# EAGLE design RelayController_RevB (EAGLE 7.6.0)

## Sheet 1 of 3
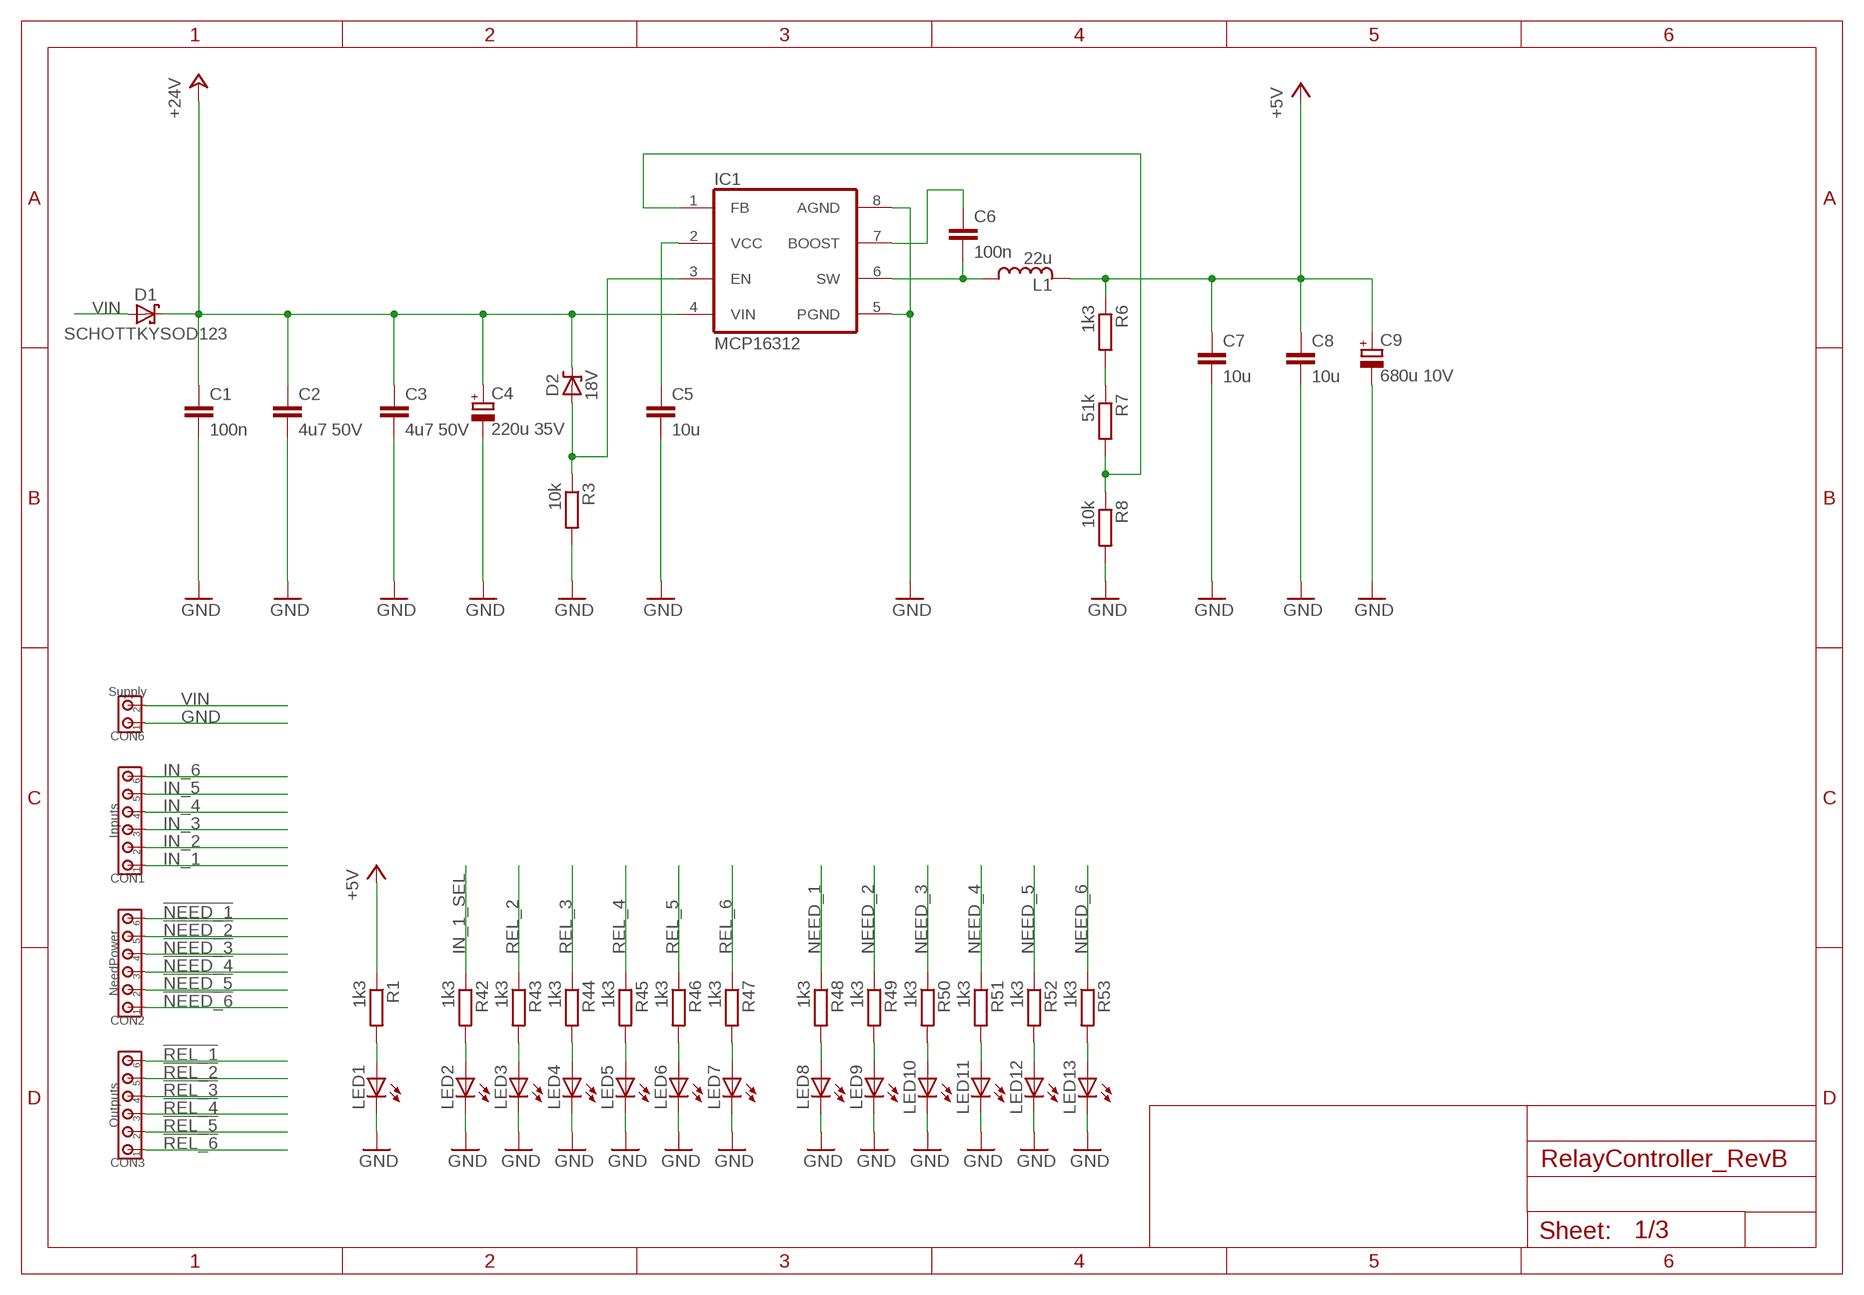
[diagram p0: schematic, sheet 1]

### Parts
C1  100n  CC0805  [C0805]
C2  4u7 50V  CC1206  [C1206]
C3  4u7 50V  CC1206  [C1206]
C4  220u 35V  C_POLARIZED8MM  [8MM]
C5  10u  CC0805  [C0805]
C6  100n  CC0805  [C0805]
C7  10u  CC0805  [C0805]
C8  10u  CC0805  [C0805]
C9  680u 10V  C_POLARIZED8MM  [8MM]
CON1  Inputs  CON_6X3.5MM  [3.5MM_6X]
CON2  NeedPower  CON_6X3.5MM  [3.5MM_6X]
CON3  Outputs  CON_6X3.5MM  [3.5MM_6X]
CON6  Supply  CON_2X3.5MM  [3.5MM_2X]
D1  SCHOTTKYSOD123  [SOD123]
D2  18V  ZENERSOD323  [SOD323]
IC1  MCP16312  MCP16311  [MSOP8]
L1  22u  INDUCTORLPS4018  [LPS4018]
LED1  LED0805_NB  [LED0805_NOBOARDER]
LED2  LED0805_NB  [LED0805_NOBOARDER]
LED3  LED0805_NB  [LED0805_NOBOARDER]
LED4  LED0805_NB  [LED0805_NOBOARDER]
LED5  LED0805_NB  [LED0805_NOBOARDER]
LED6  LED0805_NB  [LED0805_NOBOARDER]
LED7  LED0805_NB  [LED0805_NOBOARDER]
LED8  LED0805_NB  [LED0805_NOBOARDER]
LED9  LED0805_NB  [LED0805_NOBOARDER]
LED10  LED0805_NB  [LED0805_NOBOARDER]
LED11  LED0805_NB  [LED0805_NOBOARDER]
LED12  LED0805_NB  [LED0805_NOBOARDER]
LED13  LED0805_NB  [LED0805_NOBOARDER]
R1  1k3  RESISTORR0805  [R0805]
R3  10k  RESISTORR0805  [R0805]
R6  1k3  RESISTORR0805  [R0805]
R7  51k  RESISTORR0805  [R0805]
R8  10k  RESISTORR0805  [R0805]
R42  1k3  RESISTORR0805  [R0805]
R43  1k3  RESISTORR0805  [R0805]
R44  1k3  RESISTORR0805  [R0805]
R45  1k3  RESISTORR0805  [R0805]
R46  1k3  RESISTORR0805  [R0805]
R47  1k3  RESISTORR0805  [R0805]
R48  1k3  RESISTORR0805  [R0805]
R49  1k3  RESISTORR0805  [R0805]
R50  1k3  RESISTORR0805  [R0805]
R51  1k3  RESISTORR0805  [R0805]
R52  1k3  RESISTORR0805  [R0805]
R53  1k3  RESISTORR0805  [R0805]

### Nets
!NEED_1!: CON2.6 ; also sheet 2
!NEED_2!: CON2.5 ; also sheet 2
!NEED_3!: CON2.4 ; also sheet 2
!NEED_4!: CON2.3 ; also sheet 2
!NEED_5!: CON2.2 ; also sheet 2
!NEED_6!: CON2.1 ; also sheet 2
!REL_1!: CON3.6 ; also sheet 3
!REL_2!: CON3.5 ; also sheet 3
!REL_3!: CON3.4 ; also sheet 3
!REL_4!: CON3.3 ; also sheet 3
!REL_5!: CON3.2 ; also sheet 3
!REL_6!: CON3.1 ; also sheet 3
+5V: C7.1 C8.1 C9.+ L1.2 R1.1 R6.1 ; also sheet 2,3
+24V: C1.1 C2.1 C3.1 C4.+ D1.C D2.C IC1.4(VIN) ; also sheet 2,3
BOOST: C6.1 IC1.7(BOOST)
GND: C1.2 C2.2 C3.2 C4.- C5.2 C7.2 C8.2 C9.- CON6.1 IC1.5(PGND) IC1.8(AGND) LED1.C LED2.C LED3.C LED4.C LED5.C LED6.C LED7.C LED8.C LED9.C LED10.C LED11.C LED12.C LED13.C R3.2 R8.2 ; also sheet 2,3
IN_1: CON1.1 ; also sheet 2
IN_1_SEL: R42.1 ; also sheet 2
IN_2: CON1.2 ; also sheet 2
IN_3: CON1.3 ; also sheet 2
IN_4: CON1.4 ; also sheet 2
IN_5: CON1.5 ; also sheet 2
IN_6: CON1.6 ; also sheet 2
N$1: IC1.1(FB) R7.2 R8.1
N$6: LED1.A R1.2
N$8: D2.A IC1.3(EN) R3.1
N$13: R6.2 R7.1
N$14: C5.1 IC1.2(VCC)
N$17: LED2.A R42.2
N$18: LED3.A R43.2
N$19: LED4.A R44.2
N$20: LED5.A R45.2
N$21: LED6.A R46.2
N$22: LED7.A R47.2
N$23: LED8.A R48.2
N$24: LED9.A R49.2
N$25: LED10.A R50.2
N$26: LED11.A R51.2
N$27: LED12.A R52.2
N$28: LED13.A R53.2
NEED_1: R48.1 ; also sheet 2
NEED_2: R49.1 ; also sheet 2
NEED_3: R50.1 ; also sheet 2
NEED_4: R51.1 ; also sheet 2
NEED_5: R52.1 ; also sheet 2
NEED_6: R53.1 ; also sheet 2
REL_2: R43.1 ; also sheet 2,3
REL_3: R44.1 ; also sheet 2,3
REL_4: R45.1 ; also sheet 2,3
REL_5: R46.1 ; also sheet 2,3
REL_6: R47.1 ; also sheet 2,3
SWITCH: C6.2 IC1.6(SW) L1.1
VIN: CON6.2 D1.A

## Sheet 2 of 3
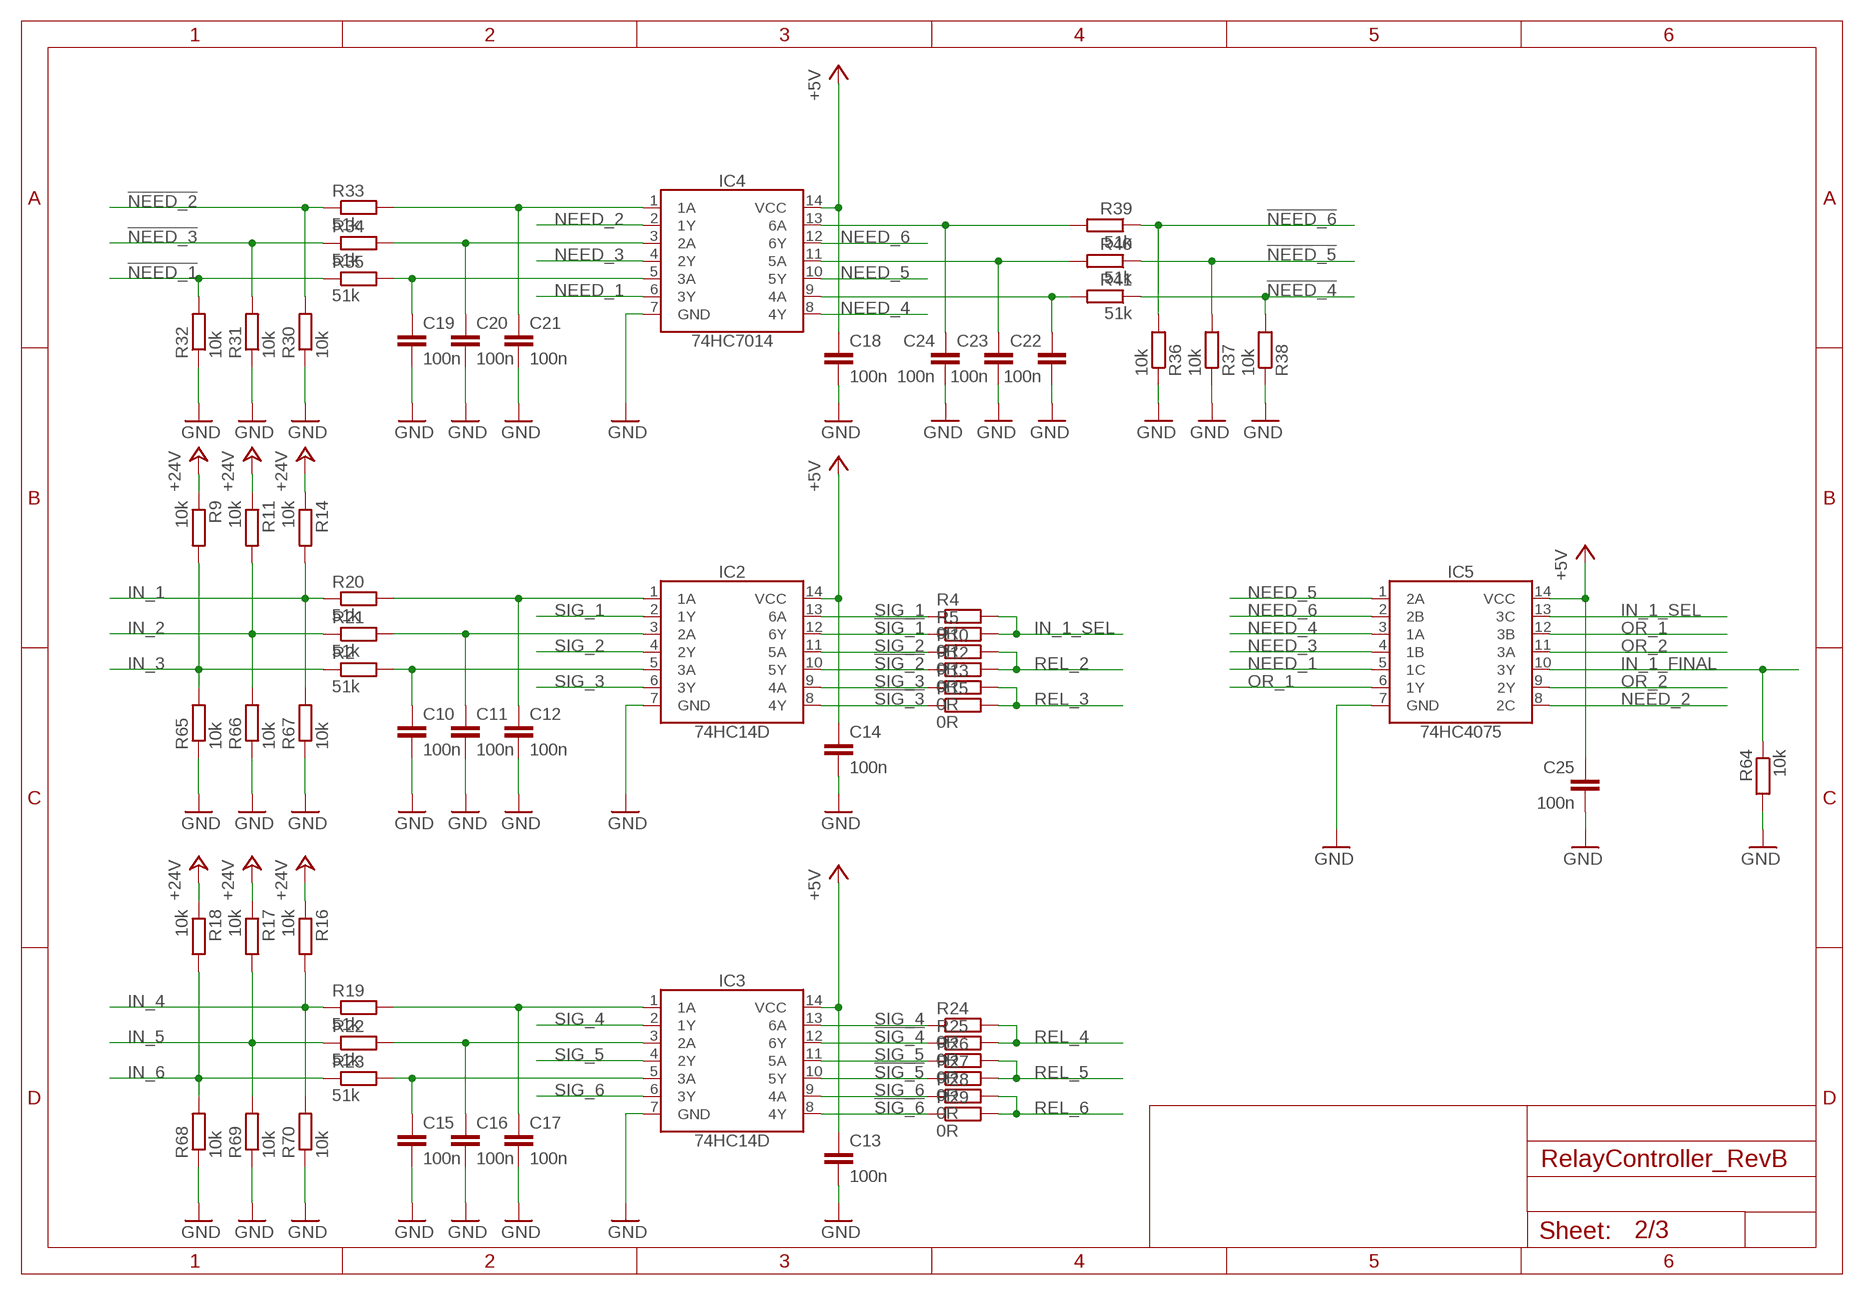
[diagram p1: schematic, sheet 2]

### Parts
C10  100n  CC0805  [C0805]
C11  100n  CC0805  [C0805]
C12  100n  CC0805  [C0805]
C13  100n  CC0805  [C0805]
C14  100n  CC0805  [C0805]
C15  100n  CC0805  [C0805]
C16  100n  CC0805  [C0805]
C17  100n  CC0805  [C0805]
C18  100n  CC0805  [C0805]
C19  100n  CC0805  [C0805]
C20  100n  CC0805  [C0805]
C21  100n  CC0805  [C0805]
C22  100n  CC0805  [C0805]
C23  100n  CC0805  [C0805]
C24  100n  CC0805  [C0805]
C25  100n  CC0805  [C0805]
IC2  74HC14D  [SO14]
IC3  74HC14D  [SO14]
IC4  74HC7014  [SO14]
IC5  74HC4075  [SO14]
R2  51k  RESISTORR0805  [R0805]
R4  0R  RESISTORR0805  [R0805]
R5  0R  RESISTORR0805  [R0805]
R9  10k  RESISTORR0805  [R0805]
R10  0R  RESISTORR0805  [R0805]
R11  10k  RESISTORR0805  [R0805]
R12  0R  RESISTORR0805  [R0805]
R13  0R  RESISTORR0805  [R0805]
R14  10k  RESISTORR0805  [R0805]
R15  0R  RESISTORR0805  [R0805]
R16  10k  RESISTORR0805  [R0805]
R17  10k  RESISTORR0805  [R0805]
R18  10k  RESISTORR0805  [R0805]
R19  51k  RESISTORR0805  [R0805]
R20  51k  RESISTORR0805  [R0805]
R21  51k  RESISTORR0805  [R0805]
R22  51k  RESISTORR0805  [R0805]
R23  51k  RESISTORR0805  [R0805]
R24  0R  RESISTORR0805  [R0805]
R25  0R  RESISTORR0805  [R0805]
R26  0R  RESISTORR0805  [R0805]
R27  0R  RESISTORR0805  [R0805]
R28  0R  RESISTORR0805  [R0805]
R29  0R  RESISTORR0805  [R0805]
R30  10k  RESISTORR0805  [R0805]
R31  10k  RESISTORR0805  [R0805]
R32  10k  RESISTORR0805  [R0805]
R33  51k  RESISTORR0805  [R0805]
R34  51k  RESISTORR0805  [R0805]
R35  51k  RESISTORR0805  [R0805]
R36  10k  RESISTORR0805  [R0805]
R37  10k  RESISTORR0805  [R0805]
R38  10k  RESISTORR0805  [R0805]
R39  51k  RESISTORR0805  [R0805]
R40  51k  RESISTORR0805  [R0805]
R41  51k  RESISTORR0805  [R0805]
R64  10k  RESISTORR0805  [R0805]
R65  10k  RESISTORR0805  [R0805]
R66  10k  RESISTORR0805  [R0805]
R67  10k  RESISTORR0805  [R0805]
R68  10k  RESISTORR0805  [R0805]
R69  10k  RESISTORR0805  [R0805]
R70  10k  RESISTORR0805  [R0805]

### Nets
!NEED_1!: R32.2 R35.1 ; also sheet 1
!NEED_2!: R30.2 R33.1 ; also sheet 1
!NEED_3!: R31.2 R34.1 ; also sheet 1
!NEED_4!: R38.2 R41.1 ; also sheet 1
!NEED_5!: R37.2 R40.1 ; also sheet 1
!NEED_6!: R36.2 R39.1 ; also sheet 1
!SIG_1!: IC2.12(6Y) R5.1
!SIG_2!: IC2.10(5Y) R12.1
!SIG_3!: IC2.8(4Y) R15.1
!SIG_4!: IC3.12(6Y) R25.1
!SIG_5!: IC3.10(5Y) R27.1
!SIG_6!: IC3.8(4Y) R29.1
+5V: C13.1 C14.1 C18.1 C25.1 IC2.14(VCC) IC3.14(VCC) IC4.14(VCC) IC5.14(VCC) ; also sheet 1,3
+24V: R9.1 R11.1 R14.1 R16.1 R17.1 R18.1 ; also sheet 1,3
FOO: C10.1 IC2.5(3A) R2.2
FOO1: C15.1 IC3.5(3A) R23.2
GND: C10.2 C11.2 C12.2 C13.2 C14.2 C15.2 C16.2 C17.2 C18.2 C19.2 C20.2 C21.2 C22.2 C23.2 C24.2 C25.2 IC2.7(GND) IC3.7(GND) IC4.7(GND) IC5.7(GND) R30.1 R31.1 R32.1 R36.1 R37.1 R38.1 R64.2 R65.1 R66.1 R67.1 R68.1 R69.1 R70.1 ; also sheet 1,3
IN_1: R14.2 R20.1 R67.2 ; also sheet 1
IN_1_FINAL: IC5.10(3Y) R64.1 ; also sheet 3
IN_1_SEL: IC5.13(3C) R4.2 R5.2 ; also sheet 1
IN_2: R11.2 R21.1 R66.2 ; also sheet 1
IN_3: R2.1 R9.2 R65.2 ; also sheet 1
IN_4: R16.2 R19.1 R70.2 ; also sheet 1
IN_5: R17.2 R22.1 R69.2 ; also sheet 1
IN_6: R18.2 R23.1 R68.2 ; also sheet 1
N$2: C17.1 IC3.1(1A) R19.2
N$4: C16.1 IC3.3(2A) R22.2
N$5: C21.1 IC4.1(1A) R33.2
N$11: C20.1 IC4.3(2A) R34.2
N$12: C24.1 IC4.13(6A) R39.2
N$15: C23.1 IC4.11(5A) R40.2
N$16: C22.1 IC4.9(4A) R41.2
N$40: C12.1 IC2.1(1A) R20.2
N$41: C11.1 IC2.3(2A) R21.2
N$111: C19.1 IC4.5(3A) R35.2
NEED_1: IC4.6(3Y) IC5.5(1C) ; also sheet 1
NEED_2: IC4.2(1Y) IC5.8(2C) ; also sheet 1
NEED_3: IC4.4(2Y) IC5.4(1B) ; also sheet 1
NEED_4: IC4.8(4Y) IC5.3(1A) ; also sheet 1
NEED_5: IC4.10(5Y) IC5.1(2A) ; also sheet 1
NEED_6: IC4.12(6Y) IC5.2(2B) ; also sheet 1
OR_1: IC5.6(1Y) IC5.12(3B)
OR_2: IC5.9(2Y) IC5.11(3A)
REL_2: R10.2 R12.2 ; also sheet 1,3
REL_3: R13.2 R15.2 ; also sheet 1,3
REL_4: R24.2 R25.2 ; also sheet 1,3
REL_5: R26.2 R27.2 ; also sheet 1,3
REL_6: R28.2 R29.2 ; also sheet 1,3
SIG_1: IC2.2(1Y) IC2.13(6A) R4.1
SIG_2: IC2.4(2Y) IC2.11(5A) R10.1
SIG_3: IC2.6(3Y) IC2.9(4A) R13.1
SIG_4: IC3.2(1Y) IC3.13(6A) R24.1
SIG_5: IC3.4(2Y) IC3.11(5A) R26.1
SIG_6: IC3.6(3Y) IC3.9(4A) R28.1

## Sheet 3 of 3
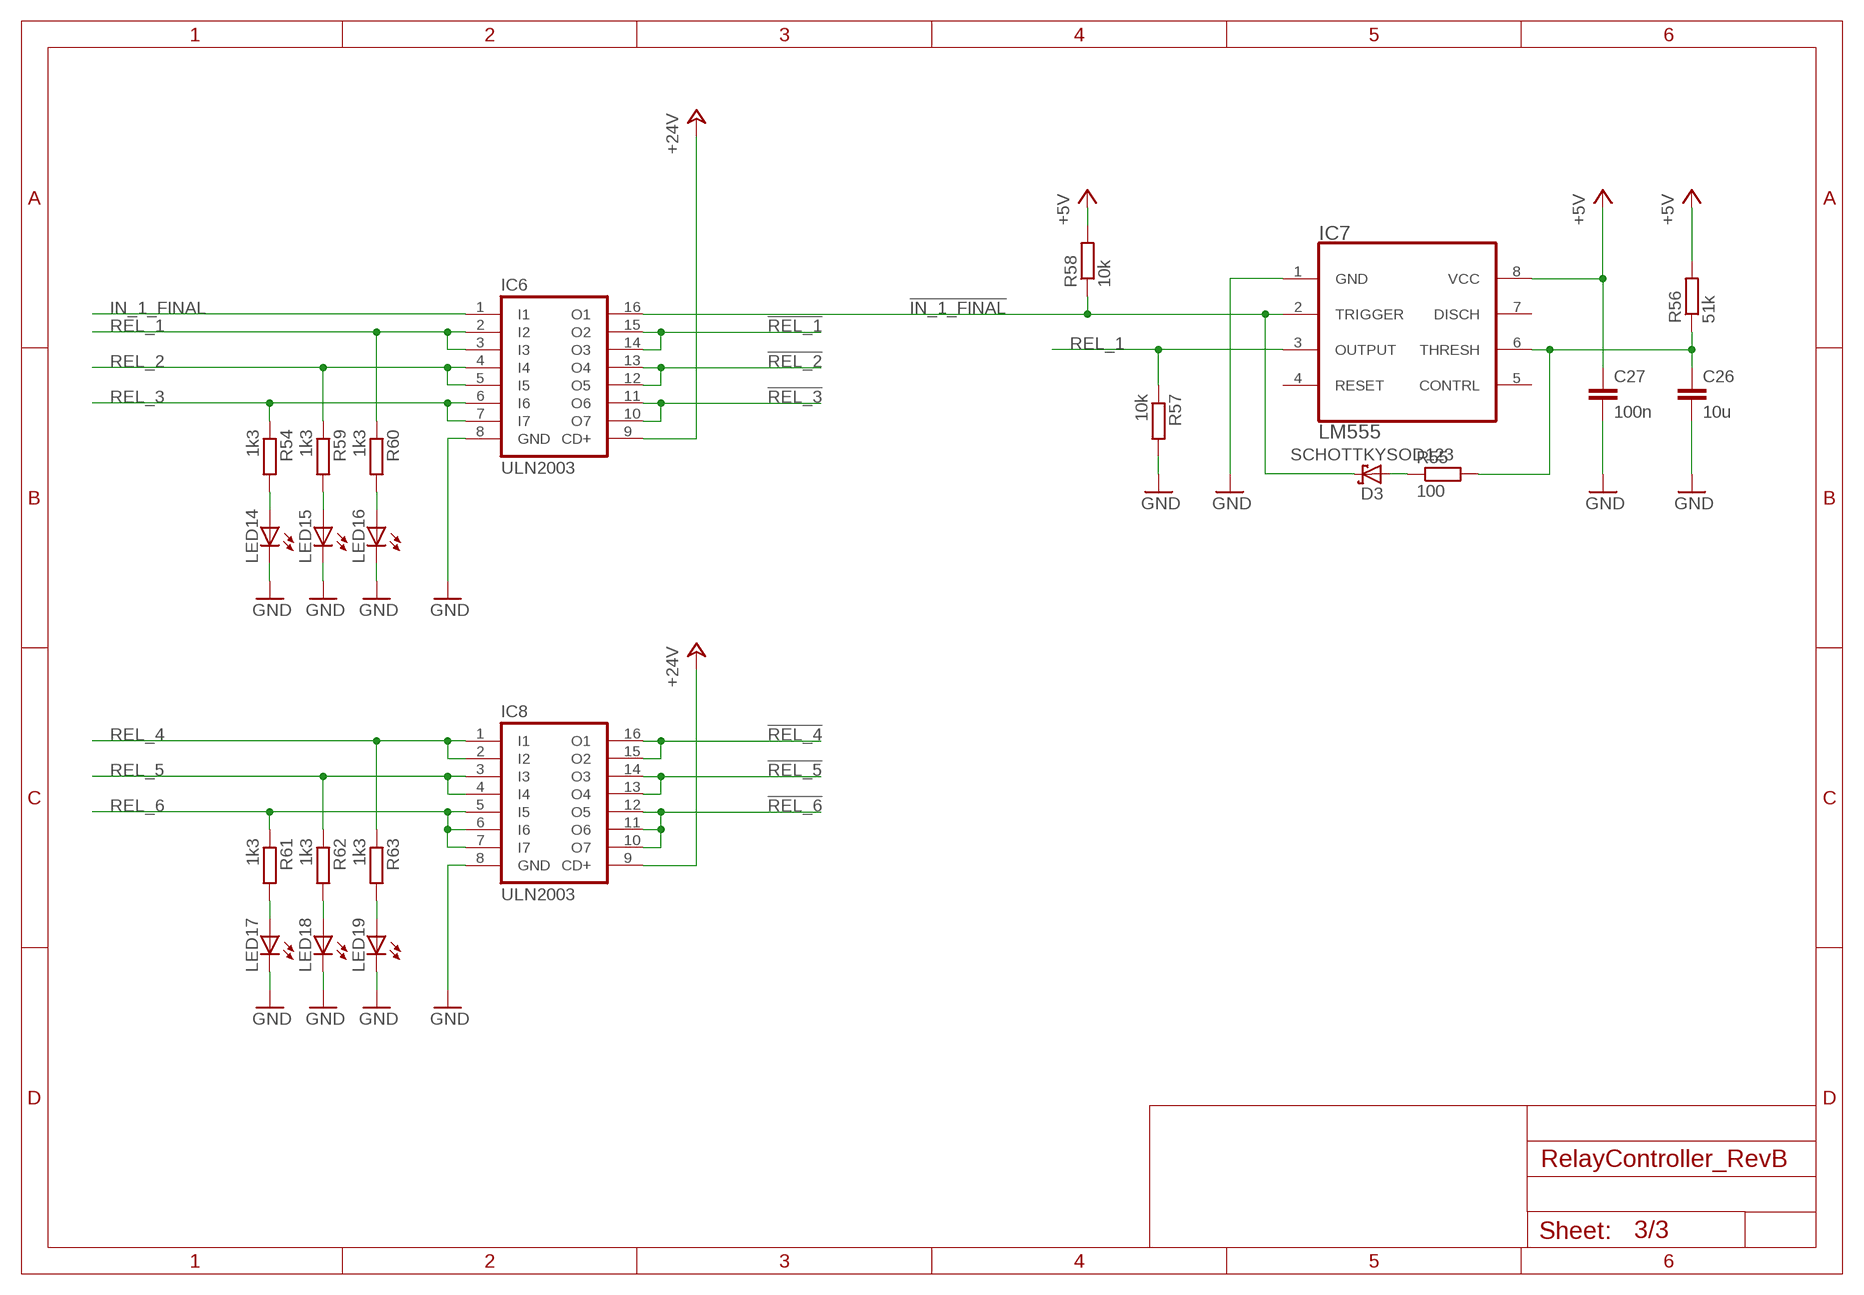
[diagram p2: schematic, sheet 3]

### Parts
C26  10u  CC0805  [C0805]
C27  100n  CC0805  [C0805]
D3  SCHOTTKYSOD123  [SOD123]
IC6  ULN2003  [SO16]
IC7  LM555  [SOIC8]
IC8  ULN2003  [SO16]
LED14  LED0805_NB  [LED0805_NOBOARDER]
LED15  LED0805_NB  [LED0805_NOBOARDER]
LED16  LED0805_NB  [LED0805_NOBOARDER]
LED17  LED0805_NB  [LED0805_NOBOARDER]
LED18  LED0805_NB  [LED0805_NOBOARDER]
LED19  LED0805_NB  [LED0805_NOBOARDER]
R54  1k3  RESISTORR0805  [R0805]
R55  100  RESISTORR0805  [R0805]
R56  51k  RESISTORR0805  [R0805]
R57  10k  RESISTORR0805  [R0805]
R58  10k  RESISTORR0805  [R0805]
R59  1k3  RESISTORR0805  [R0805]
R60  1k3  RESISTORR0805  [R0805]
R61  1k3  RESISTORR0805  [R0805]
R62  1k3  RESISTORR0805  [R0805]
R63  1k3  RESISTORR0805  [R0805]

### Nets
!IN_1_FINAL!: D3.C IC6.16(O1) IC7.2(TRIGGER) R58.1
!REL_1!: IC6.14(O3) IC6.15(O2) ; also sheet 1
!REL_2!: IC6.12(O5) IC6.13(O4) ; also sheet 1
!REL_3!: IC6.10(O7) IC6.11(O6) ; also sheet 1
!REL_4!: IC8.15(O2) IC8.16(O1) ; also sheet 1
!REL_5!: IC8.13(O4) IC8.14(O3) ; also sheet 1
!REL_6!: IC8.10(O7) IC8.11(O6) IC8.12(O5) ; also sheet 1
+5V: C27.1 IC7.8(VCC) R56.2 R58.2 ; also sheet 1,2
+24V: IC6.9(CD+) IC8.9(CD+) ; also sheet 1,2
GND: C26.2 C27.2 IC6.8(GND) IC7.1(GND) IC8.8(GND) LED14.C LED15.C LED16.C LED17.C LED18.C LED19.C R57.2 ; also sheet 1,2
IN_1_FINAL: IC6.1(I1) ; also sheet 2
N$29: C26.1 IC7.6(THRESH) R55.2 R56.1
N$30: D3.A R55.1
N$31: LED14.A R54.2
N$32: LED15.A R59.2
N$33: LED16.A R60.2
N$34: LED17.A R61.2
N$35: LED18.A R62.2
N$36: LED19.A R63.2
REL_1: IC6.2(I2) IC6.3(I3) IC7.3(OUTPUT) R57.1 R60.1
REL_2: IC6.4(I4) IC6.5(I5) R59.1 ; also sheet 1,2
REL_3: IC6.6(I6) IC6.7(I7) R54.1 ; also sheet 1,2
REL_4: IC8.1(I1) IC8.2(I2) R63.1 ; also sheet 1,2
REL_5: IC8.3(I3) IC8.4(I4) R62.1 ; also sheet 1,2
REL_6: IC8.5(I5) IC8.6(I6) IC8.7(I7) R61.1 ; also sheet 1,2
Unconnected: IC7.4(RESET) IC7.5(CONTRL) IC7.7(DISCH)

## Library data of the parts
C1-C3 C5-C8 C10-C27 = 00Capacitor:C: Capacitor
C4 C9 = 00Capacitor:C_POLARIZED
CON1-CON3 = 00Connector:CON_6X: 6-pin header
CON6 = 00Connector:CON_2X: 2-pin header
D1 D3 = 00Diode:SCHOTTKY
D2 = 00Diode:ZENER
IC1 = 00VoltageRegulator:MCP16311
IC2 IC3 = 00Logic:74HC14: Hex Inverter Schmitt Trigger
IC4 = 00Logic:74HC7014: Hex non-inverting precision Schmitt-trigger
IC5 = 00Logic:74HC4075: Triple 3-input OR gate
IC6 IC8 = 00Transistor:ULN2003: Seven Darlington array
IC7 = 00Logic:LM555
L1 = 00Inductor:INDUCTOR
LED1-LED19 = 00Display:LED: LED
R1-R70 = 00Resistor:RESISTOR: RESISTOR, European symbol

## Net classes
1 24V: clearance 0.305 mm
5 +5v: width 0.61 mm, drill 0.6 mm, clearance 0.254 mm to class 0, clearance 0.254 mm to class 1, clearance 0.254 mm to class 2, clearance 0.254 mm to class 3, clearance 0.254 mm to class 4, clearance 0.254 mm

## Board
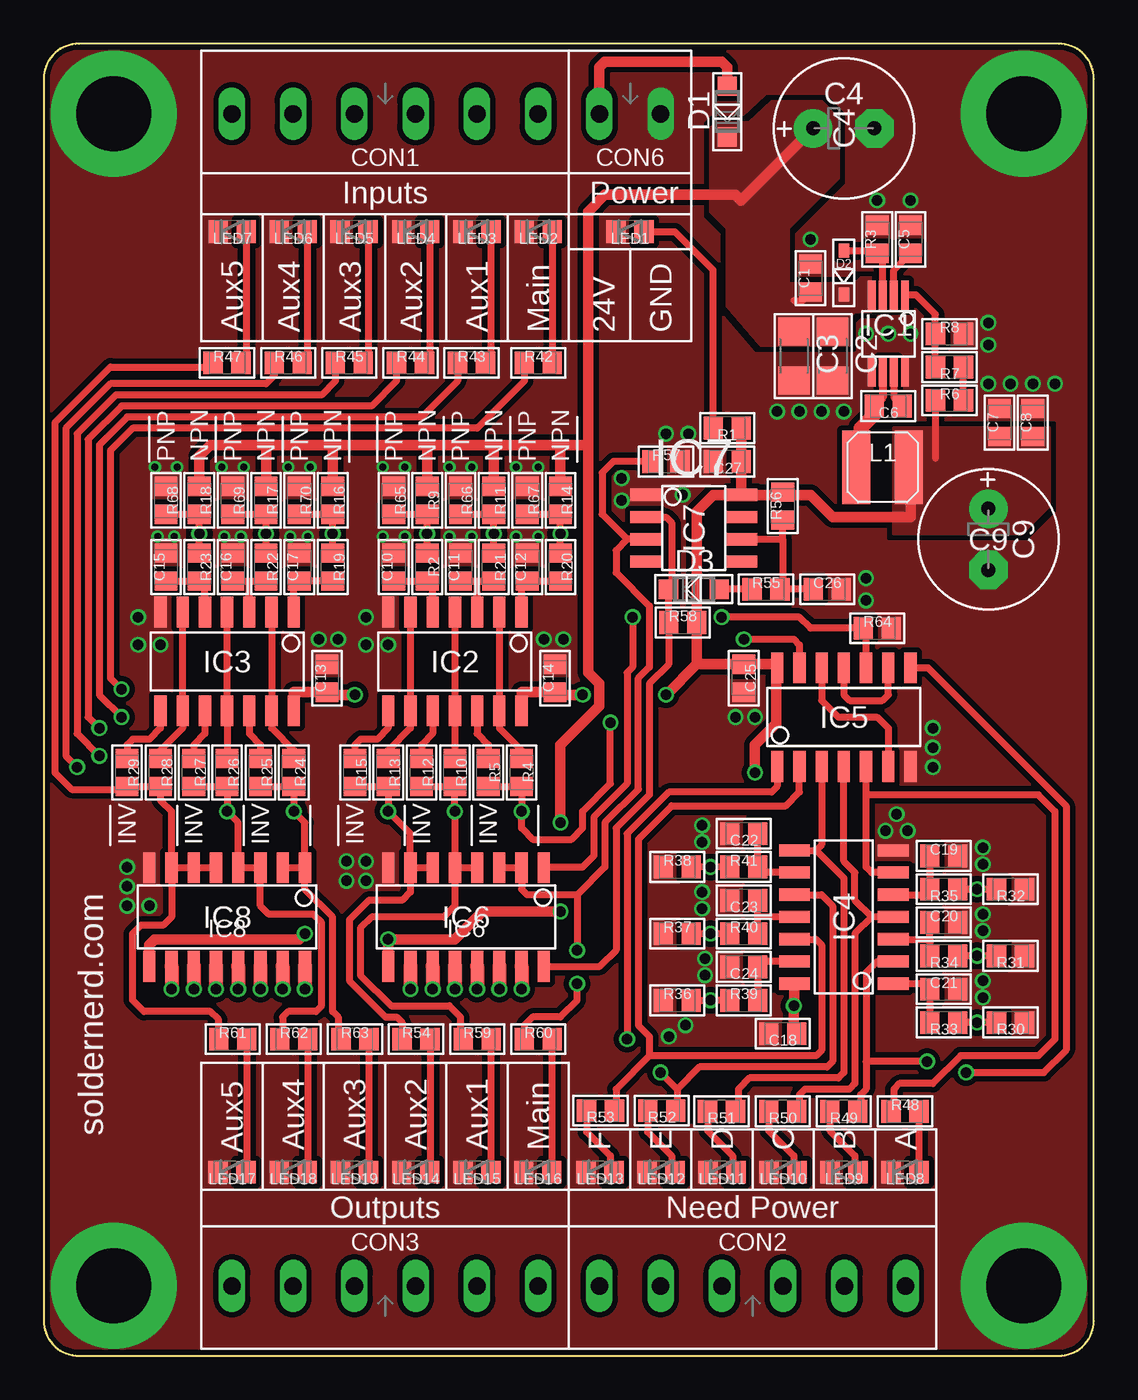
[diagram p3: board, top side]
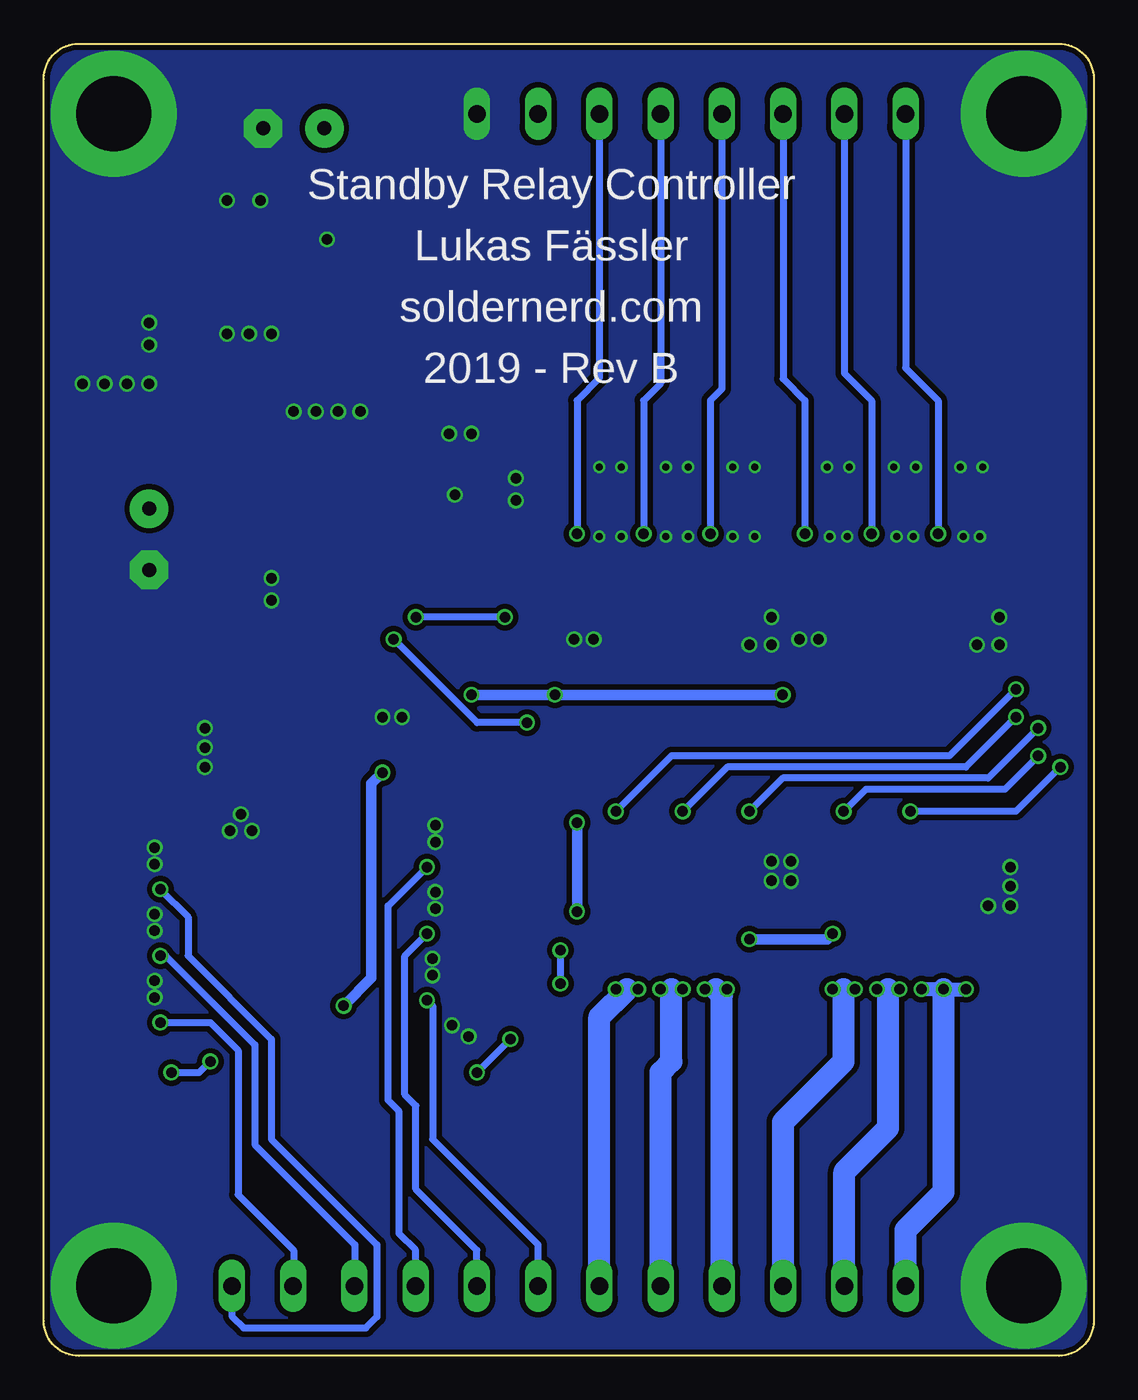
[diagram p4: board, bottom side, seen from below]

Size 60 x 75 mm. Coordinates in mm from the lower left corner, seen from the top.
Outline: 58,0 arc90 60,2 60,73 arc90 58,75 2,75 arc90 0,73 0,2 arc90 2,0 58,0
Copper layers (1*16): Top 0.035mm / dielectric 1.5mm / Bottom 0.035mm
Design rules "dirt_cheap_dirty_boards.7mil": minimum track width 5mil, minimum drill 12mil, track to track 7mil, track to pad 7mil, pad to pad 7mil, via to via 7mil, smd to smd 0mil, copper to edge 10mil, drill to drill 10mil, minimum pad ring 10mil, minimum via ring 6mil, stop-mask expansion 2mil, vias tented up to drill 25mil, thermal gap 10mil

### Footprints (pad centres in the part's own frame; a part is rotated, then mirrored left to right if it is on the bottom)
C0805 = smd 1.1 x 1.3: 1 -0.8,0; 2 0.8,0
C1206 = smd 1.6 x 1.8: 1 -1.4,0; 2 1.4,0
8MM = drill 0.8 pad 2.2: + -1.75,0 | drill 0.8 pad 2.2 octagon: - 1.75,0
3.5MM_6X = drill 1 long: 1 -8.75,0; 2 -5.25,0; 3 -1.75,0; 4 1.75,0; 5 5.25,0; 6 8.75,0
3.5MM_2X = drill 1 long: 1 -1.75,0; 2 1.75,0
SOD123 = smd 1.1 x 1.1: A 1.45,0; C -1.45,0
SOD323 = smd 0.8 x 0.6: A 1.25,0; C -1.25,0
MSOP8 = smd 1.65 x 0.45: 1 -2.2,0.953; 2 -2.2,0.318; 3 -2.2,-0.318; 4 -2.2,-0.953; 5 2.2,-0.953; 6 2.2,-0.318; 7 2.2,0.318; 8 2.2,0.953
SO14 = smd 0.7 x 1.75: 1 -3.81,-2.825; 2 -2.54,-2.825; 3 -1.27,-2.825; 4 0,-2.825; 5 1.27,-2.825; 6 2.54,-2.825; 7 3.81,-2.825; 8 3.81,2.825; 9 2.54,2.825; 10 1.27,2.825; 11 0,2.825; 12 -1.27,2.825; 13 -2.54,2.825; 14 -3.81,2.825
SO16 = smd 0.7 x 1.75: 1 -4.445,-2.825; 2 -3.175,-2.825; 3 -1.905,-2.825; 4 -0.635,-2.825; 5 0.635,-2.825; 6 1.905,-2.825; 7 3.175,-2.825; 8 4.445,-2.825; 9 4.445,2.825; 10 3.175,2.825; 11 1.905,2.825; 12 0.635,2.825; 13 -0.635,2.825; 14 -1.905,2.825; 15 -3.175,2.825; 16 -4.445,2.825
SOIC8 = smd 1.75 x 0.7: 1 -2.75,1.905; 2 -2.75,0.635; 3 -2.75,-0.635; 4 -2.75,-1.905; 5 2.75,-1.905; 6 2.75,-0.635; 7 2.75,0.635; 8 2.75,1.905
LPS4018 = smd 1.6 x 4.2: 1 -1.5,0; 2 1.5,0
LED0805_NOBOARDER = smd 1.1 x 1.3: A -0.8,0; C 0.8,0
R0805 = smd 1.1 x 1.3: 1 -0.8,0; 2 0.8,0

### Placement (x,y rotation side)
C1  43.81,61.59 90 top
C2  45.09,57.15 270 top
C3  42.86,57.15 270 top
C4  45.72,70.17 0 top
C5  49.53,63.82 90 top
C6  48.26,54.29 180 top
C7  54.61,53.34 90 top
C8  56.52,53.34 90 top
C9  53.98,46.67 270 top
C10  20,45.09 90 top
C11  23.81,45.09 90 top
C12  27.62,45.09 90 top
C13  16.19,38.73 90 top
C14  29.21,38.73 90 top
C15  6.99,45.09 90 top
C16  10.79,45.09 90 top
C17  14.61,45.09 90 top
C18  42.23,18.41 180 top
C19  51.44,28.57 0 top
C20  51.44,24.77 0 top
C21  51.44,20.95 0 top
C22  40.01,29.84 180 top
C23  40.01,26.04 180 top
C24  40.01,22.23 180 top
C25  40.01,38.73 270 top
C26  44.77,43.81 0 top
C27  39.05,51.12 180 top
CON1  19.5,71 180 top
CON2  40.5,4 0 top
CON3  19.5,4 0 top
CON6  33.5,71 180 top
D1  39.05,71.12 90 top
D2  45.72,61.91 90 top
D3  37.15,43.81 0 top
IC1  48.26,58.42 270 top
IC2  23.5,39.69 180 top
IC3  10.48,39.69 180 top
IC4  45.72,25.08 90 top
IC5  45.72,36.51 0 top
IC6  24.13,25.08 180 top
IC7  37.15,47.31 0 top
IC8  10.48,25.08 180 top
L1  47.94,50.8 0 top
LED1  33.5,64.25 180 top
LED2  28.25,64.25 180 top
LED3  24.75,64.25 180 top
LED4  21.25,64.25 180 top
LED5  17.73,64.25 180 top
LED6  14.25,64.25 180 top
LED7  10.77,64.25 180 top
LED8  49.21,10.5 180 top
LED9  45.73,10.5 180 top
LED10  42.24,10.5 180 top
LED11  38.76,10.5 180 top
LED12  35.27,10.5 180 top
LED13  31.79,10.5 180 top
LED14  21.25,10.5 180 top
LED15  24.75,10.5 180 top
LED16  28.23,10.5 180 top
LED17  10.75,10.5 180 top
LED18  14.25,10.5 180 top
LED19  17.75,10.5 180 top
R1  39.05,53.02 180 top
R2  21.91,45.09 270 top
R3  47.62,63.82 90 top
R4  27.3,33.34 270 top
R5  25.4,33.34 270 top
R6  51.75,54.61 0 top
R7  51.75,56.52 180 top
R8  51.75,58.42 0 top
R9  21.91,48.9 270 top
R10  23.5,33.34 270 top
R11  25.72,48.9 270 top
R12  21.59,33.34 270 top
R13  19.68,33.34 270 top
R14  29.53,48.9 270 top
R15  17.78,33.34 270 top
R16  16.51,48.9 270 top
R17  12.7,48.9 270 top
R18  8.89,48.9 270 top
R19  16.51,45.09 270 top
R20  29.53,45.09 270 top
R21  25.72,45.09 270 top
R22  12.7,45.09 270 top
R23  8.89,45.09 270 top
R24  14.29,33.34 270 top
R25  12.38,33.34 270 top
R26  10.48,33.34 270 top
R27  8.57,33.34 270 top
R28  6.67,33.34 270 top
R29  4.76,33.34 270 top
R30  55.24,19.05 180 top
R31  55.24,22.86 180 top
R32  55.24,26.67 180 top
R33  51.44,19.05 180 top
R34  51.44,22.86 180 top
R35  51.44,26.67 180 top
R36  36.2,20.32 0 top
R37  36.2,24.13 0 top
R38  36.2,27.94 0 top
R39  40.01,20.32 0 top
R40  40.01,24.13 0 top
R41  40.01,27.94 0 top
R42  28.26,56.75 0 top
R43  24.45,56.75 0 top
R44  20.95,56.75 0 top
R45  17.46,56.75 0 top
R46  13.97,56.75 0 top
R47  10.48,56.75 0 top
R48  49.21,13.97 0 top
R49  45.72,13.97 180 top
R50  42.23,13.97 180 top
R51  38.73,13.97 180 top
R52  35.31,14.02 180 top
R53  31.82,14.02 180 top
R54  21.27,18.1 0 top
R55  41.27,43.81 0 top
R56  42.23,48.58 90 top
R57  35.56,51.12 0 top
R58  36.51,41.91 0 top
R59  24.77,18.1 0 top
R60  28.26,18.1 0 top
R61  10.79,18.1 0 top
R62  14.29,18.1 0 top
R63  17.78,18.1 0 top
R64  47.62,41.59 0 top
R65  20,48.9 270 top
R66  23.81,48.9 270 top
R67  27.62,48.9 270 top
R68  6.99,48.9 270 top
R69  10.79,48.9 270 top
R70  14.61,48.9 270 top

### Tracks (layer width: path | path; a pad name or v marks a point on that pad's centre or on a via)
!IN_1_FINAL!
  Top 0.406: IC6.16 31.78,22.26 32.7,23.18 32.7,30.16 34.61,32.07 34.61,38.42 35.71,39.52 R58.1 35.71,43.8 D3.C 35.88,43.99 35.88,47.62 35.56,47.94 IC7.2
!NEED_1!  (via drill 0.6)
  Top 0.406: R32.2 v53.34,26.67 R35.1
  Bottom 0.406: CON2.6 49.25,2.26 48.58,1.59 41.59,1.59 40.96,2.22 40.96,6.35 46.99,12.38 46.99,18.1 51.75,22.86 51.75,25.08 v53.34,26.67
!NEED_2!  (via drill 0.6)
  Top 0.406: R30.2 v53.34,19.05 R33.1
  Bottom 0.406: 45.72,3.97 45.72,6.03 48.9,9.21 48.9,17.46 50.48,19.05 v53.34,19.05 | 45.72,3.97 45.72,3.78 | CON2.5 45.72,3.97
!NEED_3!  (via drill 0.6)
  Top 0.406: R31.2 v53.34,22.86 R34.1
  Bottom 0.406: v53.34,22.86 53.02,22.86 47.94,17.78 47.94,12.06 42.23,6.35 42.23,4.02 CON2.4
!NEED_4!  (via drill 0.6)
  Top 0.406: R41.1 v38.1,27.94 R38.2
  Bottom 0.406: CON2.3 38.75,6.05 39.69,6.99 39.69,13.97 40.32,14.61 40.32,25.72 v38.1,27.94
!NEED_5!  (via drill 0.6)
  Top 0.406: R37.2 v38.1,24.13 R40.1
  Bottom 0.406: CON2.2 35.25,6.04 38.73,9.53 38.73,14.29 39.37,14.92 39.37,22.86 v38.1,24.13
!NEED_6!  (via drill 0.6)
  Top 0.406: R39.1 v38.1,20.32 R36.2
  Bottom 0.406: CON2.1 31.75,6.35 37.78,12.38 37.78,20 v38.1,20.32
!REL_1!  (via drill 0.6)
  Top 0.813: IC6.15 v27.3,20.95 | IC6.14 v26.04,20.95
  Bottom 0.813: v26.04,20.95 26.67,20.95 v27.3,20.95
  Bottom 1.27: CON3.6 28.25,19.38 26.67,20.95
!REL_2!  (via drill 0.6)
  Top 0.813: IC6.13 v24.77,20.95 | IC6.12 v23.5,20.95
  Bottom 0.813: v23.5,20.95 24.13,20.95 v24.77,20.95
  Bottom 1.27: CON3.5 24.75,16.21 24.13,16.83 24.13,20.95
!REL_3!  (via drill 0.6)
  Top 0.813: IC6.11 v22.23,20.95 | IC6.10 v20.95,20.95
  Bottom 0.813: v22.23,20.95 21.59,20.95 v20.95,20.95
  Bottom 1.27: CON3.4 21.25,20.61 21.59,20.95
!REL_4!  (via drill 0.6)
  Top 0.813: IC8.16 v14.92,20.95 | IC8.15 v13.65,20.95
  Bottom 0.813: v13.65,20.95 14.29,20.95 v14.92,20.95
  Bottom 1.27: CON3.3 17.75,13.37 14.29,16.83 14.29,20.95
!REL_5!  (via drill 0.6)
  Top 0.813: IC8.14 v12.38,20.95 | IC8.13 v11.11,20.95
  Bottom 0.813: v12.38,20.95 11.75,20.95 v11.11,20.95
  Bottom 1.27: CON3.2 14.25,10.52 11.75,13.02 11.75,20.95
!REL_6!  (via drill 0.6)
  Top 0.813: IC8.10 v7.3,20.95 | IC8.12 v9.84,20.95 | IC8.11 v8.57,20.95
  Bottom 0.813: v7.3,20.95 v8.57,20.95 v9.84,20.95
  Bottom 1.27: CON3.1 10.75,7.19 8.57,9.37 v8.57,20.95
!SIG_1!
  Top 0.406: IC2.12 24.77,35.56 25.4,34.92 R5.1
!SIG_2!
  Top 0.406: IC2.10 22.23,35.56 21.59,34.92 R12.1
!SIG_3!
  Top 0.406: IC2.8 19.68,35.88 19.05,35.24 18.1,35.24 17.78,34.92 R15.1
!SIG_4!
  Top 0.406: IC3.12 11.75,35.56 12.38,34.92 R25.1
!SIG_5!
  Top 0.406: IC3.10 9.21,35.56 8.57,34.92 R27.1
!SIG_6!
  Top 0.406: IC3.8 6.67,35.88 6.03,35.24 5.08,35.24 4.76,34.92 R29.1
+5V  (via drill 0.6)
  Top 0.406: R6.1 50.95,51.29
  Top 0.61: R1.1 C27.1 39.85,49.26 IC7.8 | v17.78,37.78 16.34,37.78 C13.1 14.29,37.94 IC3.14 | v30.8,37.78 29.36,37.78 C14.1 27.3,37.94 IC2.14 | IC4.14 42.9,20.04 v42.86,20 42.86,18.58 C18.1 | IC7.8 38.26,49.21 37.31,48.27 R58.2 37.31,39.69 37.47,39.53 | IC7.8 42.06,49.21 R56.2 42.39,49.21 43.81,49.21 45.09,47.94 49.53,47.94 49.53,50.71 L1.2 | v40.64,33.34 40.64,34.92 41.85,36.14 41.85,39.28 IC5.14 41.71,39.53 C25.1 37.47,39.53 | 37.47,39.53 37.31,39.53 v35.56,37.78
  Bottom 0.61: v17.78,37.78 v30.8,37.78 v35.56,37.78 | v42.86,20 41.27,21.59 41.27,32.7 v40.64,33.34
  pour Top (isolate 0.406, no thermals): 48.58,53.02 57.47,53.02 57.47,48.58 55.88,46.99 48.58,46.99
+24V  (via drill 0.6)
  Top 0.406: 42.86,60.33 43.34,60.33
  Top 0.61: IC6.9 v19.68,23.81 23.5,23.81 25.08,25.4 v29.53,25.4 | R18.1 8.89,51.44 9.53,52.07 12.7,52.07 | 12.7,52.07 16.51,52.07 | 16.51,52.07 21.91,52.07 | 21.91,52.07 25.72,52.07 | 25.72,52.07 29.53,52.07 | R14.1 29.53,52.07 | R11.1 25.72,52.07 | R9.1 21.91,52.07 | R16.1 16.51,52.07 | R17.1 12.7,52.07 | IC8.9 6.03,23.5 6.35,23.81 14.61,23.81 v14.92,24.13 | C4.+ 39.84,66.04 39.52,66.36 32.07,66.36 31.11,65.41 31.11,52.07 | 29.53,52.07 31.11,52.07 | 31.11,52.07 31.11,39.05 31.75,38.42 31.75,37.15 29.53,34.92 v29.53,30.48
  Bottom 0.61: v29.53,30.48 v29.53,25.4 | v14.92,24.13 15.24,23.81 v19.68,23.81
  pour Top (isolate 0.406, no thermals): 47.31,61.59 47.31,59.69 46.35,59.69 46.04,59.37 46.04,57.78 40.96,57.78 39.05,60.01 39.05,64.45 38.1,65.41 38.1,70.17 38.42,70.48 40.32,70.48 41.59,71.67 44.45,71.67 45.4,70.72 45.4,67.31 42.55,64.45 42.55,61.28 46.35,61.28 46.67,61.59
BOOST
  Top 0.406: IC1.7 48.58,54.77 C6.1
FOO
  Top 0.406: C10.1 R2.2 22.23,43.97 IC2.5
FOO1
  Top 0.406: C15.1 R23.2 9.21,44.28 IC3.5
GND  (via drill 0.4, 0.6, 4.3 pad 7.2)
  other vias: 4,71 56,71 56,4 4,4 41.91,53.98 45.72,53.98 43.81,63.82 6.67,40.64 53.66,21.43 53.66,25.24 14.08,46.83 20.64,46.83 37.62,29.37 53.66,28.1 10.32,46.83 5.4,42.23 37.62,25.56 16.83,40.96 37.78,22.7 50.8,33.66 49.37,30 35.56,52.7 39.53,36.51 29.69,40.96 53.98,55.56 56.52,55.56 50.8,34.77 19.37,46.83 23.18,46.83 24.45,46.83 26.99,46.83 28.26,46.83 6.35,50.8 7.62,50.8 10.16,50.8 11.43,50.8 13.97,50.8 15.24,50.8 20.64,50.8 19.37,50.8 28.26,50.8 26.99,50.8 24.45,50.8 23.18,50.8 36.67,18.89 35.72,18.26 46.99,58.42 48.26,58.42 49.53,58.42 57.78,55.56 55.24,55.56 44.45,53.98 43.18,53.98 47.62,66.04 49.53,66.04 53.98,59.05 53.98,57.78 33.02,50.16 33.02,48.9 36.51,49.21 36.83,52.7 46.99,44.45 46.99,43.18 40.64,36.51 50.8,35.88 48.1,30 48.74,30.96 53.66,29.05 53.66,24.29 37.62,30.32 37.62,26.51 37.78,21.75 53.66,20.48 4.76,27.94 4.76,26.83 4.76,25.72 6.03,25.72 17.3,28.26 18.41,28.26 18.41,27.15 17.3,27.15 5.4,40.64 15.72,40.96 18.41,42.23 19.68,40.64 18.41,40.64 28.57,40.96 15.08,46.83 11.27,46.83 7.46,46.83 6.51,46.83
  pour Bottom (isolate 0.305, rank 3, no thermals): 58,0 2,0 arc-90 0,2 0,73 arc-90 2,75 58,75 arc-90 60,73 60,2 arc-90
  pour Top (isolate 0.305, rank 3, no thermals): 0,2 0,73 arc-90 2,75 58,75 arc-90 60,73 60,2 arc-90 58,0 2,0 arc-90
IN_1  (via drill 0.6)
  Top 0.406: R20.1 v29.53,46.99 R14.2 R67.2
  Bottom 0.406: CON1.1 28.25,55.89 29.53,54.61 v29.53,46.99
IN_1_FINAL  (via drill 0.6)
  Top 0.406: IC6.1 28.57,27.94 30.8,27.94 31.43,28.57 31.43,30.8 33.34,32.7 33.34,39.05 33.66,39.37 v33.66,42.23 | IC5.10 46.99,41.43 R64.1 43.81,41.59 43.18,42.23 v38.73,42.23
  Bottom 0.406: v33.66,42.23 v38.73,42.23
IN_1_SEL  (via drill 0.6)
  Top 0.406: R42.1 27.46,55.72 24.77,53.02 5.08,53.02 3.81,51.75 3.81,38.73 v4.45,38.1 | R5.2 R4.2 v27.3,31.11 27.3,30.16 27.94,29.53 30.16,29.53 30.8,30.16 30.8,31.11 32.38,32.7 v32.38,36.2 | v40.01,40.96 42.86,40.96 43.18,40.64 IC5.13
  Bottom 0.406: v4.45,38.1 8.26,34.29 24.13,34.29 v27.3,31.11 | v32.38,36.2 35.24,36.2 v40.01,40.96
IN_2  (via drill 0.6)
  Top 0.406: R21.1 v25.72,46.99 R11.2 R66.2
  Bottom 0.406: CON1.2 24.75,55.58 25.72,54.61 v25.72,46.99
IN_3  (via drill 0.6)
  Top 0.406: R2.1 v21.91,46.99 R9.2 R65.2
  Bottom 0.406: CON1.3 21.25,55.27 21.91,54.61 v21.91,46.99
IN_4  (via drill 0.6)
  Top 0.406: R19.1 v16.51,46.99 R16.2 R70.2
  Bottom 0.406: CON1.4 17.75,55.85 16.51,54.61 v16.51,46.99
IN_5  (via drill 0.6)
  Top 0.406: R22.1 v12.7,46.99 R17.2 R69.2
  Bottom 0.406: CON1.5 14.25,56.16 12.7,54.61 v12.7,46.99
IN_6  (via drill 0.6)
  Top 0.406: R23.1 v8.89,46.99 R18.2 R68.2
  Bottom 0.406: CON1.6 10.75,56.47 8.89,54.61 v8.89,46.99
N$1
  Top 0.406: R7.2 R8.1 50.95,59.54 49.85,60.64 49.23,60.64 IC1.1
N$2
  Top 0.406: R19.2 C17.1 14.29,44.28 IC3.1
N$4
  Top 0.406: C16.1 11.75,44.28 | 11.75,44.28 R22.2 | IC3.3 11.75,44.28
N$5
  Top 0.406: R33.2 C21.1 50.63,21.27 IC4.1
N$6
  Top 0.406: LED1.A 36.07,64.25 38.25,62.06 R1.2
N$8
  Top 0.406: IC1.3 47.94,62.7 R3.1 | 47.48,63.16 R3.1 | D2.A 45.74,63.18 47.62,63.18 R3.1
N$11
  Top 0.406: C20.1 50.63,24.13 50.63,23.81 | 50.63,23.81 R34.2 | IC4.3 50.63,23.81
N$12
  Top 0.406: R39.2 C24.1 40.8,22.54 IC4.13
N$13
  Top 0.406: R6.2 R7.1
N$14
  Top 0.406: IC1.2 48.58,62.06 C5.1
N$15
  Top 0.406: R40.2 40.8,25.08 | 40.8,25.08 C23.1 | IC4.11 40.8,25.08
N$16
  Top 0.406: C22.1 R41.2 40.8,27.62 IC4.9
N$17
  Top 0.406: LED2.A R42.2
N$18
  Top 0.406: LED3.A 25.55,57.05 R43.2
N$19
  Top 0.406: LED4.A 22.05,57.05 R44.2
N$20
  Top 0.406: LED5.A 18.54,57.02 R45.2
N$21
  Top 0.406: LED6.A 15.05,57.03 R46.2
N$22
  Top 0.406: LED7.A 11.56,57.04 R47.2
N$23
  Top 0.406: R48.2 LED8.A
N$24
  Top 0.406: LED9.A 46.35,10.67 46.35,11.43 44.92,12.87 R49.2
N$25
  Top 0.406: R50.2 41.43,12.87 42.86,11.43 42.86,10.68 LED10.A
N$26
  Top 0.406: R51.2 37.94,12.87 39.37,11.43 39.37,10.69 LED11.A
N$27
  Top 0.406: R52.2 34.51,12.8 35.88,11.43 35.88,10.7 LED12.A
N$28
  Top 0.406: R53.2 31.02,12.8 32.38,11.43 32.38,10.7 LED13.A
N$29
  Top 0.406: C26.1 R55.2 42.23,43.97 42.23,46.67 | IC7.6 42.23,46.67 | 42.23,46.67 R56.1
N$30
  Top 0.406: R55.1 D3.A
N$31
  Top 0.406: R54.2 22.07,10.52 LED14.A
N$32
  Top 0.406: R59.2 25.55,18.08 LED15.A
N$33
  Top 0.406: R60.2 29.04,18.07 LED16.A
N$34
  Top 0.406: R61.2 11.6,10.54 LED17.A
N$35
  Top 0.406: R62.2 15.09,10.54 LED18.A
N$36
  Top 0.406: R63.2 18.58,10.53 LED19.A
N$40
  Top 0.406: IC2.1 27.3,43.97 C12.1 R20.2
N$41
  Top 0.406: C11.1 24.77,44.28 | 24.77,44.28 R21.2 | IC2.3 24.77,44.28
N$111
  Top 0.406: C19.1 R35.2 | R35.2 | IC4.5 50.63,26.35 R35.2
NEED_1
  Top 0.406: IC4.6 47.31,27.62 46.99,27.94 46.99,32.07 | 46.99,32.07 56.83,32.07 57.78,31.11 57.78,18.1 56.83,17.14 52.39,17.14 50.8,15.56 48.9,15.56 48.58,15.24 48.58,14.13 R48.1 | 46.99,32.07 IC5.5
NEED_2  (via drill 0.6)
  Top 0.406: IC4.2 47.62,22.54 46.99,21.91 46.99,16.83 | v50.48,16.83 46.99,16.83 | 46.99,16.83 46.99,15.24 46.67,14.92 46.67,14.12 R49.1 | v52.7,16.19 57.15,16.19 58.42,17.46 58.42,31.43 50.52,39.34 IC5.8
  Bottom 0.406: v52.7,16.19 51.12,16.19 v50.48,16.83
NEED_3
  Top 0.406: IC4.4 47.31,25.08 | 47.31,25.08 46.35,24.13 46.35,15.56 46.04,15.24 43.5,15.24 43.18,14.92 43.18,14.12 R50.1 | 47.31,25.08 46.35,26.04 46.35,27.62 45.72,28.26 IC5.4
NEED_4
  Top 0.406: IC4.8 44.13,28.89 | 44.13,28.89 45.72,27.3 45.72,16.19 45.4,15.88 40.32,15.88 39.69,15.24 39.69,14.12 R51.1 | IC5.3 44.45,29.21 44.13,28.89
NEED_5  (via drill 0.6)
  Top 0.406: IC4.10 44.45,26.35 45.09,25.72 45.09,16.83 44.77,16.51 37.47,16.51 36.2,15.24 | v33.34,18.1 33.34,29.84 35.72,32.23 41.59,32.23 41.91,32.54 IC5.1 | 36.2,15.24 36.2,14.1 R52.1 | v35.24,16.19 36.2,15.24
  Bottom 0.406: v35.24,16.19 v33.34,18.1
NEED_6
  Top 0.406: IC4.12 44.13,23.81 44.45,23.5 44.45,17.46 44.13,17.14 34.61,17.14 | 34.61,17.14 32.7,15.24 32.7,14.1 R53.1 | 34.61,17.14 34.61,18.26 33.97,18.89 33.97,29.53 35.88,31.43 42.39,31.43 43.18,32.23 IC5.2
OR_1
  Top 0.406: IC5.12 44.45,37.47 45.4,36.51 47.62,36.51 48.26,35.88 IC5.6
OR_2
  Top 0.406: IC5.11 45.72,37.78 46.04,37.47 47.94,37.47 48.26,37.78 IC5.9
REL_1  (via drill 0.6)
  Top 0.406: IC6.3 IC6.2 27.3,26.67 27.62,26.35 30.48,26.35 | R60.1 27.46,18.89 27.94,19.37 29.53,19.37 30.48,20.32 v30.48,21.27 | R57.1 32.54,51.12 31.91,50.48 31.91,48.1 33.34,46.67 | IC7.3 33.34,46.67 | 33.34,46.67 32.7,46.04 32.7,44.77 34.61,42.86 34.61,39.37 33.97,38.73 33.97,32.38 32.07,30.48 32.07,27.94 30.48,26.35 | 30.48,26.35 v30.48,23.18
  Bottom 0.406: v30.48,23.18 v30.48,21.27
REL_2  (via drill 0.6)
  Top 0.406: R43.1 23.65,55.72 21.59,53.66 4.76,53.66 3.17,52.07 3.17,37.78 v4.45,36.51 | R12.2 R10.2 v23.5,31.11 IC6.5 | IC6.5 IC6.4 | IC6.5 23.5,25.72 22.86,25.08 18.73,25.08 18.1,24.45 18.1,21.75 19.84,20 23.18,20 23.81,19.37 23.81,18.25 R59.1
  Bottom 0.406: v4.45,36.51 7.3,33.66 20.95,33.66 v23.5,31.11
REL_3  (via drill 0.6)
  Top 0.406: R44.1 20.16,55.72 18.73,54.29 4.45,54.29 2.54,52.39 2.54,36.51 v3.17,35.88 | R15.2 R13.2 v19.68,31.11 20.95,29.84 IC6.7 | IC6.7 IC6.6 | IC6.7 20.95,26.51 20.48,26.04 18.57,26.04 17.46,24.92 17.46,21.43 19.53,19.37 20.16,19.37 20.48,19.05 R54.1
  Bottom 0.406: v3.17,35.88 6.03,33.02 17.78,33.02 v19.68,31.11
REL_4  (via drill 0.6)
  Top 0.406: R25.2 R24.2 v14.29,31.11 14.92,30.48 IC8.1 | IC8.2 IC8.1 | R45.1 16.66,55.72 15.88,54.93 4.13,54.93 1.91,52.7 1.91,35.56 v3.17,34.29 | IC8.1 14.92,26.67 16.51,25.08 16.51,19.68 16.83,19.37 16.83,18.25 R63.1
  Bottom 0.406: v3.17,34.29 5.08,32.38 13.02,32.38 v14.29,31.11
REL_5  (via drill 0.6)
  Top 0.406: R27.2 R26.2 v10.48,31.11 11.11,30.48 IC8.4 IC8.3 12.38,25.72 12.86,25.24 15.4,25.24 15.88,24.77 15.88,20 15.56,19.68 13.97,19.68 13.65,19.37 13.65,18.26 R62.1 | R46.1 13.17,56.03 12.7,55.56 3.81,55.56 1.27,53.02 1.27,34.29 v1.91,33.66
  Bottom 0.406: v1.91,33.66 4.45,31.11 v10.48,31.11
REL_6
  Top 0.406: IC8.7 7.3,31.11 6.67,31.75 R28.2 R29.2 4.61,32.38 1.59,32.38 0.64,33.34 0.64,53.34 3.81,56.52 9.44,56.52 R47.1 9.68,56.59 | IC8.7 IC8.6 IC8.5 | R61.1 9.99,19.21 9.53,19.68 5.71,19.68 5.08,20.32 5.08,24.13 5.56,24.61 6.83,24.61 7.3,25.08 IC8.7
SIG_1
  Top 0.406: IC2.2 IC2.13 26.04,35.88 27.3,34.61 R4.1
SIG_2
  Top 0.406: IC2.4 IC2.11 R10.1
SIG_3
  Top 0.406: IC2.6 IC2.9 20.95,35.88 19.68,34.61 R13.1
SIG_4
  Top 0.406: IC3.2 IC3.13 13.02,35.88 14.29,34.61 R24.1
SIG_5
  Top 0.406: IC3.4 IC3.11 R26.1
SIG_6
  Top 0.406: IC3.6 IC3.9 7.94,35.88 6.67,34.61 R28.1
SWITCH
  Top 0.457: IC1.6 47.94,54.77 C6.2
  Top 0.813: C6.2 47.46,53.81 46.67,53.02 46.67,51.03 L1.1
VIN
  Top 0.61: D1.A 39.05,73.66 38.73,73.98 32.07,73.98 31.75,73.66 CON6.2

### Text on the board
tPlace: Inputs | Power | Aux5 | Aux4 | Aux3 | Aux2 | Aux1 | Main | 24V | GND | PNP | NPN | PNP | NPN | PNP | NPN | PNP | NPN | PNP | NPN | PNP | NPN | INV | INV | INV | INV | INV | INV | soldernerd.com | Aux5 | Aux4 | Aux3 | Aux2 | Aux1 | Main | F | E | D | C | B | A | Outputs | Need Power
bPlace: Standby Relay Controller | Lukas Fässler | soldernerd.com | 2019 - Rev B